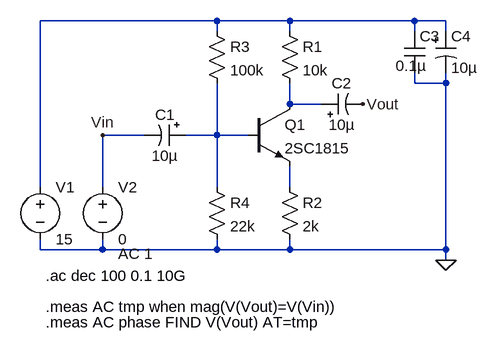
[diagram p0: schematic MEAS.asc]
MEAS.asc, the LTspice schematic file:
Version 4
SHEET 1 880 680
WIRE 32 -32 -240 -32
WIRE 144 -32 32 -32
WIRE 336 -32 144 -32
WIRE 384 -32 336 -32
WIRE 32 -16 32 -32
WIRE 144 -16 144 -32
WIRE 336 -16 336 -32
WIRE 384 -16 384 -32
WIRE 336 64 336 48
WIRE 384 64 384 48
WIRE 384 64 336 64
WIRE 144 96 144 64
WIRE 192 96 144 96
WIRE -80 144 -144 144
WIRE 32 144 32 64
WIRE 32 144 -16 144
WIRE 80 144 32 144
WIRE -240 224 -240 -32
WIRE -144 224 -144 144
WIRE 32 224 32 144
WIRE 144 224 144 192
WIRE -240 320 -240 304
WIRE -144 320 -144 304
WIRE -144 320 -240 320
WIRE 32 320 32 304
WIRE 32 320 -144 320
WIRE 144 320 144 304
WIRE 144 320 32 320
WIRE 384 320 384 64
WIRE 384 320 144 320
WIRE 384 336 384 320
FLAG 384 336 0
FLAG -144 144 Vin
FLAG 256 96 Vout
SYMBOL npn 80 96 R0
SYMATTR InstName Q1
SYMATTR Value 2SC1815
SYMBOL res 128 -32 R0
SYMATTR InstName R1
SYMATTR Value 10k
SYMBOL res 128 208 R0
SYMATTR InstName R2
SYMATTR Value 2k
SYMBOL res 16 -32 R0
SYMATTR InstName R3
SYMATTR Value 100k
SYMBOL res 16 208 R0
SYMATTR InstName R4
SYMATTR Value 22k
SYMBOL voltage -240 208 R0
WINDOW 123 0 0 Left 0
WINDOW 39 0 0 Left 0
SYMATTR InstName V1
SYMATTR Value 15
SYMBOL voltage -144 208 R0
WINDOW 123 24 118 Left 2
WINDOW 39 0 0 Left 0
SYMATTR Value2 AC 1
SYMATTR InstName V2
SYMATTR Value 0
SYMBOL polcap -16 128 R90
WINDOW 0 0 32 VBottom 2
WINDOW 3 32 32 VTop 2
SYMATTR InstName C1
SYMATTR Value 10µ
SYMBOL cap 320 -16 R0
WINDOW 3 -13 53 Left 2
SYMATTR Value 0.1µ
SYMATTR InstName C3
SYMBOL polcap 368 -16 R0
SYMATTR InstName C4
SYMATTR Value 10µ
SYMBOL /polcap 192 112 R270
WINDOW 0 32 32 VTop 2
WINDOW 3 0 32 VBottom 2
SYMATTR InstName C2
SYMATTR Value 10µ
TEXT -232 360 Left 2 !.ac dec 100 0.1 10G
TEXT -232 408 Left 2 !.meas AC tmp when mag(V(Vout)=V(Vin))
TEXT -232 432 Left 2 !.meas AC phase FIND V(Vout) AT=tmp

The netlist it stands for:
* MEAS.asc
Q1 N002 N003 N004 0 2SC1815
R1 N001 N002 10k
R2 N004 0 2k
R3 N001 N003 100k
R4 N003 0 22k
V1 N001 0 15
V2 Vin 0 0 AC 1
C1 N003 Vin 10µ
C3 N001 0 0.1µ
C4 N001 0 10µ
C2 N002 Vout 10µ
.model NPN NPN
.model PNP PNP
.lib standard.bjt
.ac dec 100 0.1 10G
.meas AC tmp when mag(V(Vout)=V(Vin))
.meas AC phase FIND V(Vout) AT=tmp
.backanno
.end